# Altium schematic sheet bpf_main.SchDoc: mcHF Pro Transceiver RF board
size A3; Author: Krassi Atanassov; CompanyName: MØNKA; Engineer: For radio amateurs experimentation, non-commercial use only. Thank you!; Revision: 0.8.2; SheetTotal: 14
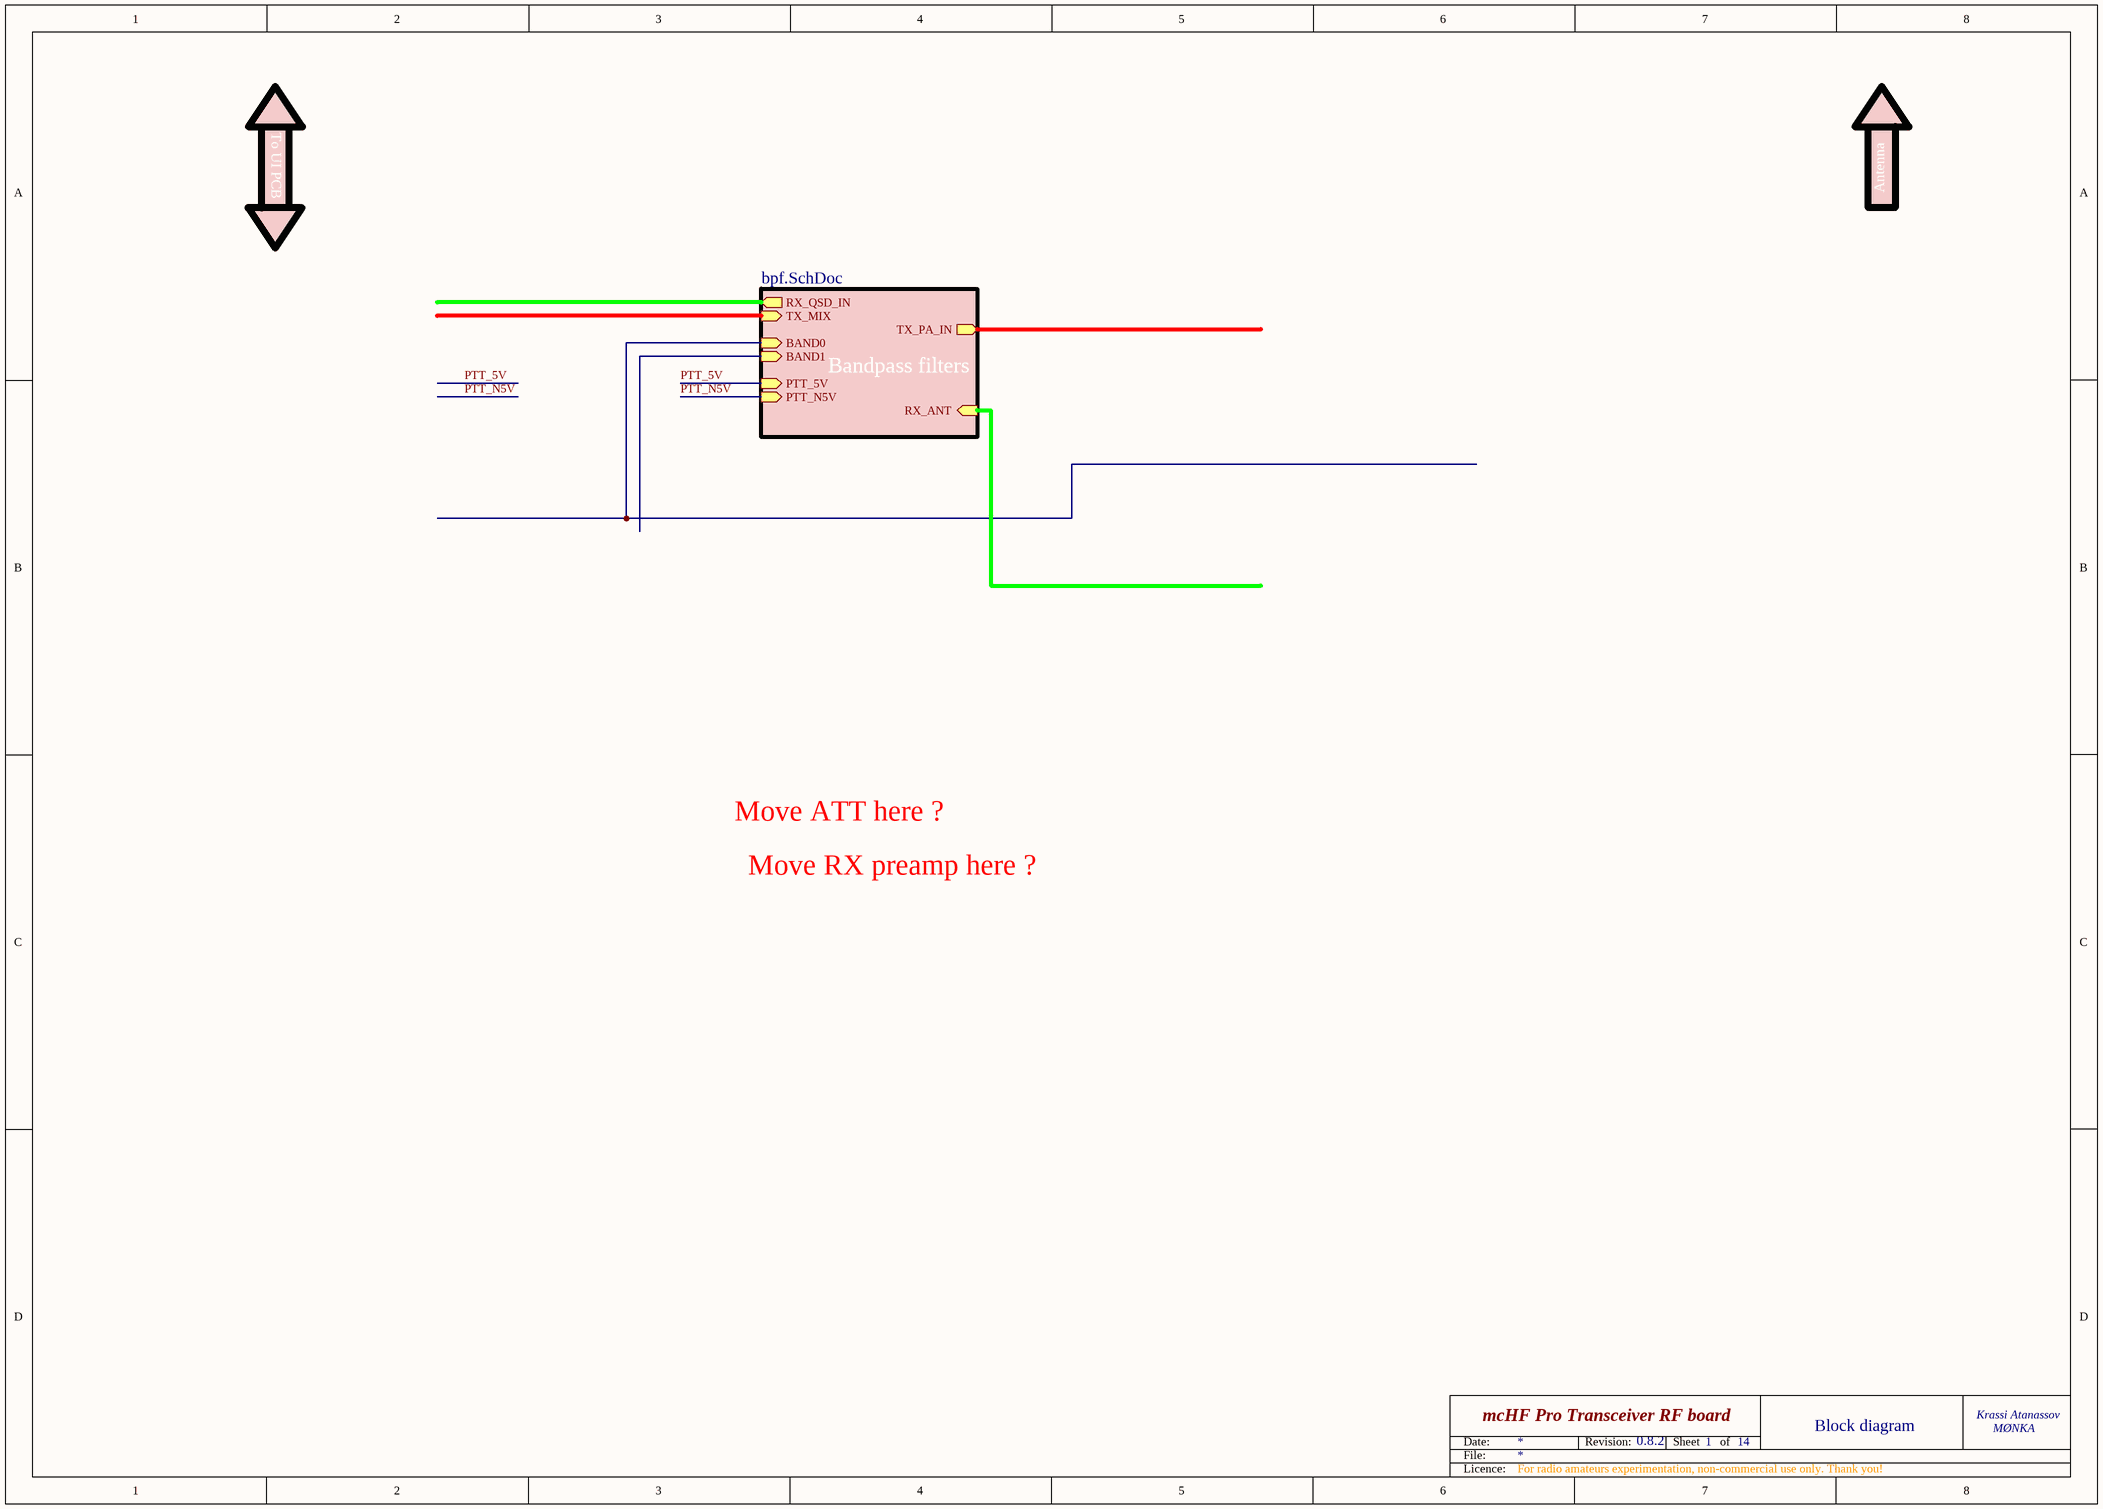
[diagram p0: bpf_main.SchDoc]

## Sub-sheets
Bandpass filters = bpf.SchDoc: BAND0 (in), BAND1 (in), PTT_5V (in), RX_ANT (in), TX_PA_IN (out), PTT_N5V (in), RX_QSD_IN (out), TX_MIX (in)

## Nets
PTT_5V: sheet Bandpass filters/PTT_5V
PTT_N5V: sheet Bandpass filters/PTT_N5V

## Notes on the sheet
- To UI PCB
- Antenna
- Move ATT here ?
- Move RX preamp here ?
- 1
- Block diagram
- Date:
- File:
- Revision:
- Sheet
- of
- Licence: